# EAGLE schematic mmcaudio (EAGLE 6.4)
AUTHOR: Dat Le

## Sheet 1 of 3
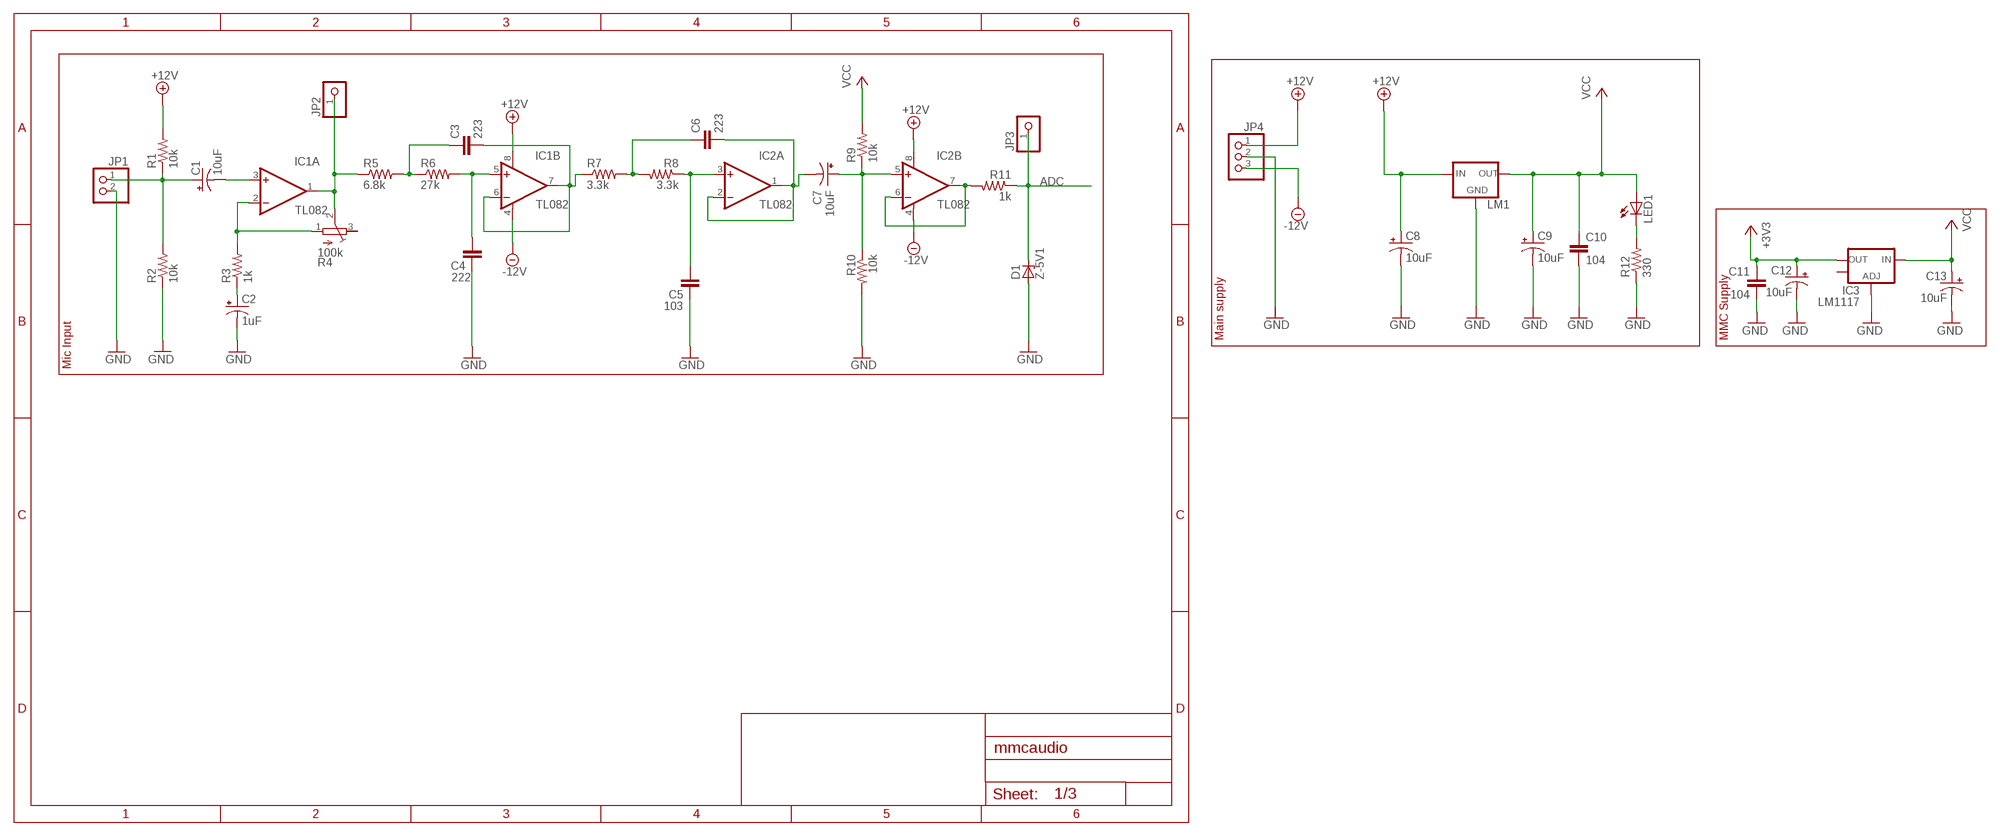
[diagram p0: schematic, sheet 1]

### Parts
C1  10uF  CPOL-USSANYO_D  [POL-CAP-COMMON]
C2  1uF  CPOL-USSANYO_D  [POL-CAP-COMMON]
C3  223  C-EUCERAMIC-CAP-COMMON  [C025-060X050]
C4  222  C-EUCERAMIC-CAP-COMMON  [C025-060X050]
C5  103  C-EUCERAMIC-CAP-COMMON  [C025-060X050]
C6  223  C-EUCERAMIC-CAP-COMMON  [C025-060X050]
C7  10uF  CPOL-USSANYO_D  [POL-CAP-COMMON]
C8  10uF  CPOL-USSANYO_D  [POL-CAP-COMMON]
C9  10uF  CPOL-USSANYO_D  [POL-CAP-COMMON]
C10  104  C-EUCERAMIC-CAP-COMMON  [C025-060X050]
C11  104  C-EUCERAMIC-CAP-COMMON  [C025-060X050]
C12  10uF  CPOL-USSANYO_D  [POL-CAP-COMMON]
C13  10uF  CPOL-USSANYO_D  [POL-CAP-COMMON]
D1  Z-5V1  [DO35Z7]
IC1  TL082  [DIP08]
IC2  TL082  [DIP08]
IC3  LM1117  V_REG_LM1117SOT223  [SOT223]
JP1  PINHD-1X2  [1X02]
JP2  PINHD-1X1  [1X01]
JP3  PINHD-1X1  [1X01]
JP4  PINHD-1X30.2"  [1X03/0.2"]
LED1  LED5MM  [LED5MM]
LM1  V_REG_78XXSINK  [TO220-IGO]
R1  10k  R-US_0207/10  [R-US-COMMON]
R2  10k  R-US_0207/10  [R-US-COMMON]
R3  1k  R-US_0207/10  [R-US-COMMON]
R4  100k  R-TRIMM64W  [RTRIM-COMMON]
R5  6.8k  R-US_0207/10  [R-US-COMMON]
R6  27k  R-US_0207/10  [R-US-COMMON]
R7  3.3k  R-US_0207/10  [R-US-COMMON]
R8  3.3k  R-US_0207/10  [R-US-COMMON]
R9  10k  R-US_0207/10  [R-US-COMMON]
R10  10k  R-US_0207/10  [R-US-COMMON]
R11  1k  R-US_0207/10  [R-US-COMMON]
R12  330  R-US_0207/10  [R-US-COMMON]

### Nets
+3V3: C11.1 C12.+ IC3.2(OUT) ; also sheet 2
+12V: C8.+ IC1.8(B:V+) IC2.8(B:V+) JP4.1 LM1.IN R1.2 ; also sheet 3
-12V: IC1.4(B:V-) IC2.4(B:V-) JP4.3 ; also sheet 3
ADC: D1.C JP3.1 R11.1 ; also sheet 2
GND: C2.- C4.1 C5.1 C8.- C9.- C10.2 C11.2 C12.- C13.- D1.A IC3.1(ADJ) JP1.2 JP4.2 LM1.GND R2.1 R10.2 R12.1 ; also sheet 2,3
N$1: C1.- IC1.3(A:+IN)
N$2: IC1.2(A:-IN) R3.2 R4.1(A)
N$3: IC1.1(A:OUT) JP2.1 R4.2(S) R5.1
N$4: C3.1 R5.2 R6.1
N$5: C4.2 IC1.5(B:+IN) R6.2
N$6: C3.2 IC1.6(B:-IN) IC1.7(B:OUT) R7.1
N$7: C6.1 R7.2 R8.2
N$8: C5.2 IC2.3(A:+IN) R8.1
N$9: C6.2 C7.- IC2.1(A:OUT) IC2.2(A:-IN)
N$10: C7.+ IC2.5(B:+IN) R9.1 R10.1
N$11: IC2.6(B:-IN) IC2.7(B:OUT) R11.2
N$13: C1.+ JP1.1 R1.1 R2.2
N$31: C2.+ R3.1
N$37: LED1.K(C) R12.2
VCC: C9.+ C10.1 C13.+ IC3.3(IN) LED1.A LM1.OUT R9.2 ; also sheet 2,3
Unconnected: IC3.4(OUT) R4.3(E)

### Notes on the sheet
- Main supply | MMC Supply
- Mic Input

## Sheet 2 of 3
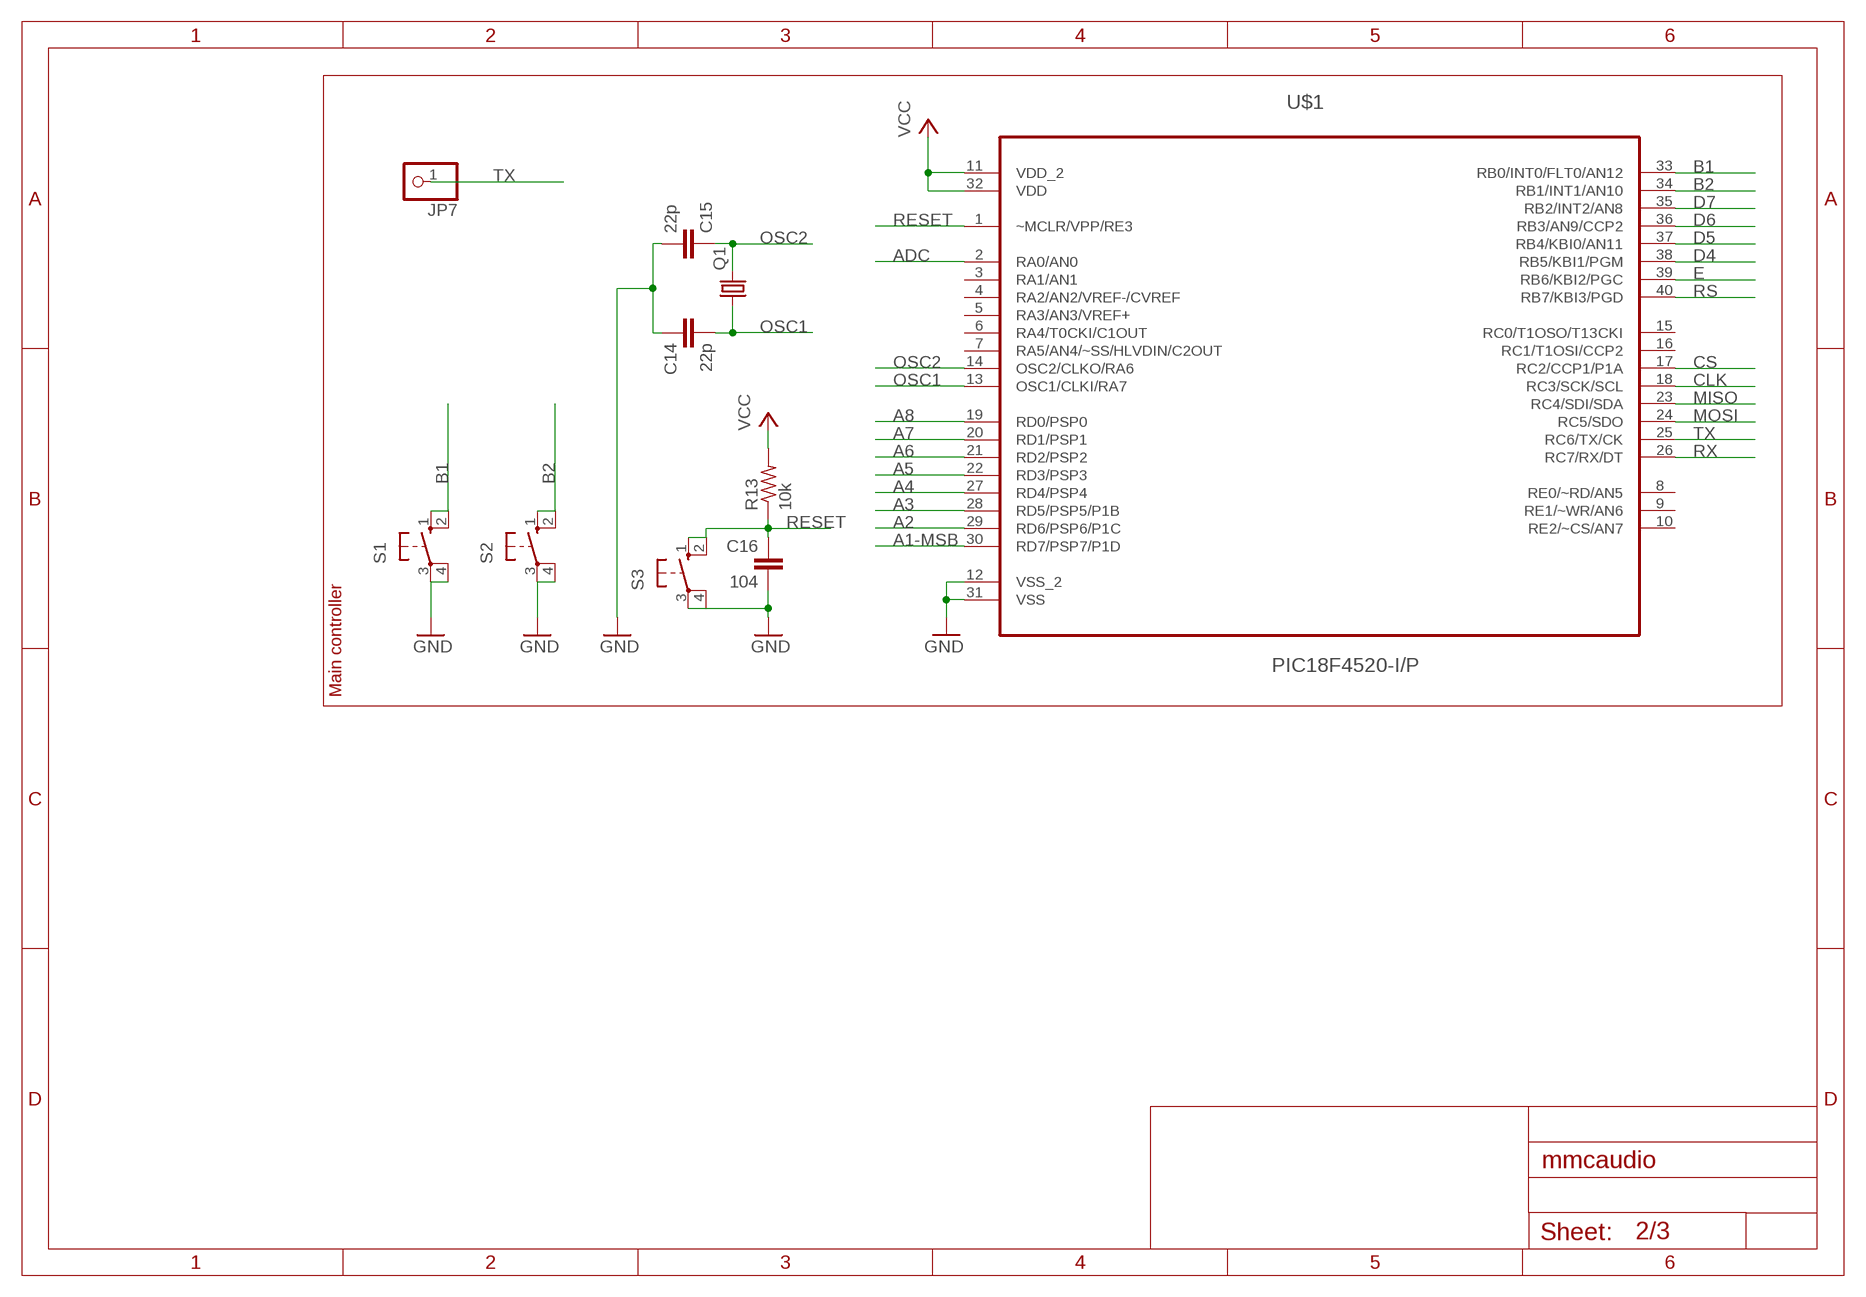
[diagram p1: schematic, sheet 2, part 1 of 2]
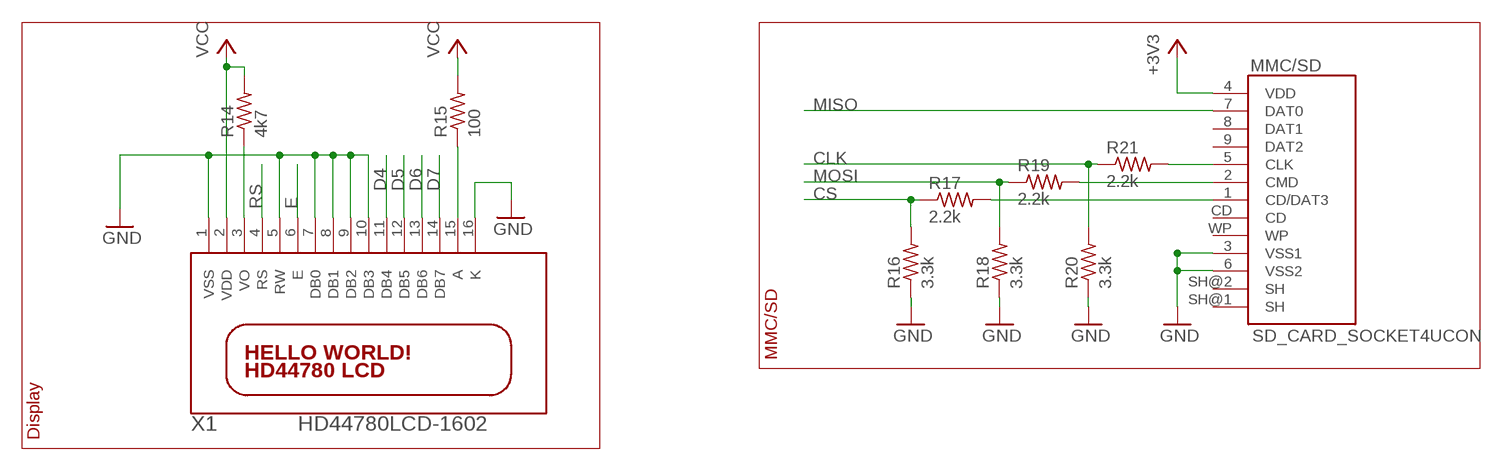
[diagram p2: schematic, sheet 2, part 2 of 2]

### Parts
C14  22p  C-EUCERAMIC-CAP-COMMON  [C025-060X050]
C15  22p  C-EUCERAMIC-CAP-COMMON  [C025-060X050]
C16  104  C-EUCERAMIC-CAP-COMMON  [C025-060X050]
JP7  PINHD-1X1  [1X01]
MMC/SD  SD_CARD_SOCKET4UCON  [SDCARD_4UCONN]
Q1  CRYSTALHC49S  [HC49/S]
R13  10k  R-US_0207/10  [R-US-COMMON]
R14  4k7  R-US_0207/10  [R-US-COMMON]
R15  100  R-US_0207/10  [R-US-COMMON]
R16  3.3k  R-US_0207/10  [R-US-COMMON]
R17  2.2k  R-US_0207/10  [R-US-COMMON]
R18  3.3k  R-US_0207/10  [R-US-COMMON]
R19  2.2k  R-US_0207/10  [R-US-COMMON]
R20  3.3k  R-US_0207/10  [R-US-COMMON]
R21  2.2k  R-US_0207/10  [R-US-COMMON]
S1  10-XX  [B3F-10XX]
S2  10-XX  [B3F-10XX]
S3  10-XX  [B3F-10XX]
U$1  PIC18F4520-I/P  [DIP254P1524X533-40]
X1  HD44780LCD-1602  [LCD1602]

### Nets
+3V3: MMC/SD.4(VDD) ; also sheet 1
A1-MSB: U$1.30(RD7/PSP7/P1D) ; also sheet 3
A2: U$1.29(RD6/PSP6/P1C) ; also sheet 3
A3: U$1.28(RD5/PSP5/P1B) ; also sheet 3
A4: U$1.27(RD4/PSP4) ; also sheet 3
A5: U$1.22(RD3/PSP3) ; also sheet 3
A6: U$1.21(RD2/PSP2) ; also sheet 3
A7: U$1.20(RD1/PSP1) ; also sheet 3
A8: U$1.19(RD0/PSP0) ; also sheet 3
ADC: U$1.2(RA0/AN0) ; also sheet 1
B1: S1.1(S) S1.2(S1) U$1.33(RB0/INT0/FLT0/AN12)
B2: S2.1(S) S2.2(S1) U$1.34(RB1/INT1/AN10)
CLK: R20.2 R21.1 U$1.18(RC3/SCK/SCL)
CONTR: R14.1 X1.3(VO)
CS: R16.2 R17.1 U$1.17(RC2/CCP1/P1A)
D4: U$1.38(RB5/KBI1/PGM) X1.11(DB4)
D5: U$1.37(RB4/KBI0/AN11) X1.12(DB5)
D6: U$1.36(RB3/AN9/CCP2) X1.13(DB6)
D7: U$1.35(RB2/INT2/AN8) X1.14(DB7)
E: U$1.39(RB6/KBI2/PGC) X1.6(E)
GND: C14.1 C15.2 C16.2 MMC/SD.3(VSS1) MMC/SD.6(VSS2) R16.1 R18.1 R20.1 S1.3(P) S1.4(P1) S2.3(P) S2.4(P1) S3.3(P) S3.4(P1) U$1.12(VSS_2) U$1.31(VSS) X1.16(K) ; also sheet 1,3
MISO: MMC/SD.7(DAT0) U$1.23(RC4/SDI/SDA)
MOSI: R18.2 R19.1 U$1.24(RC5/SDO)
N$32: R15.1 X1.15(A)
N$36: MMC/SD.1(CD/DAT3) R17.2
N$38: MMC/SD.2(CMD) R19.2
N$40: MMC/SD.5(CLK) R21.2
OSC1: C14.2 Q1.1 U$1.13(OSC1/CLKI/RA7)
OSC2: C15.1 Q1.2 U$1.14(OSC2/CLKO/RA6)
RESET: C16.1 R13.1 S3.1(S) S3.2(S1) U$1.1(~MCLR/VPP/RE3)
RS: U$1.40(RB7/KBI3/PGD) X1.4(RS)
RX: U$1.26(RC7/RX/DT)
TX: JP7.1 U$1.25(RC6/TX/CK)
VCC: R13.2 R15.2 U$1.11(VDD_2) U$1.32(VDD) ; also sheet 1,3
VDD: R14.2 X1.2(VDD) ; supply symbol labelled VCC
VSS: X1.1(VSS) X1.5(RW) X1.7(DB0) X1.8(DB1) X1.9(DB2) X1.10(DB3) ; supply symbol labelled GND
Unconnected: MMC/SD.8(DAT1) MMC/SD.9(DAT2) MMC/SD.CD MMC/SD.SH@1(SH) MMC/SD.SH@2(SH) MMC/SD.WP U$1.3(RA1/AN1) U$1.4(RA2/AN2/VREF-/CVREF) U$1.5(RA3/AN3/VREF+) U$1.6(RA4/T0CKI/C1OUT) U$1.7(RA5/AN4/~SS/HLVDIN/C2OUT) U$1.8(RE0/~RD/AN5) U$1.9(RE1/~WR/AN6) U$1.10(RE2/~CS/AN7) U$1.15(RC0/T1OSO/T13CKI) U$1.16(RC1/T1OSI/CCP2)

### Notes on the sheet
- MMC/SD
- Display
- Main controller

## Sheet 3 of 3
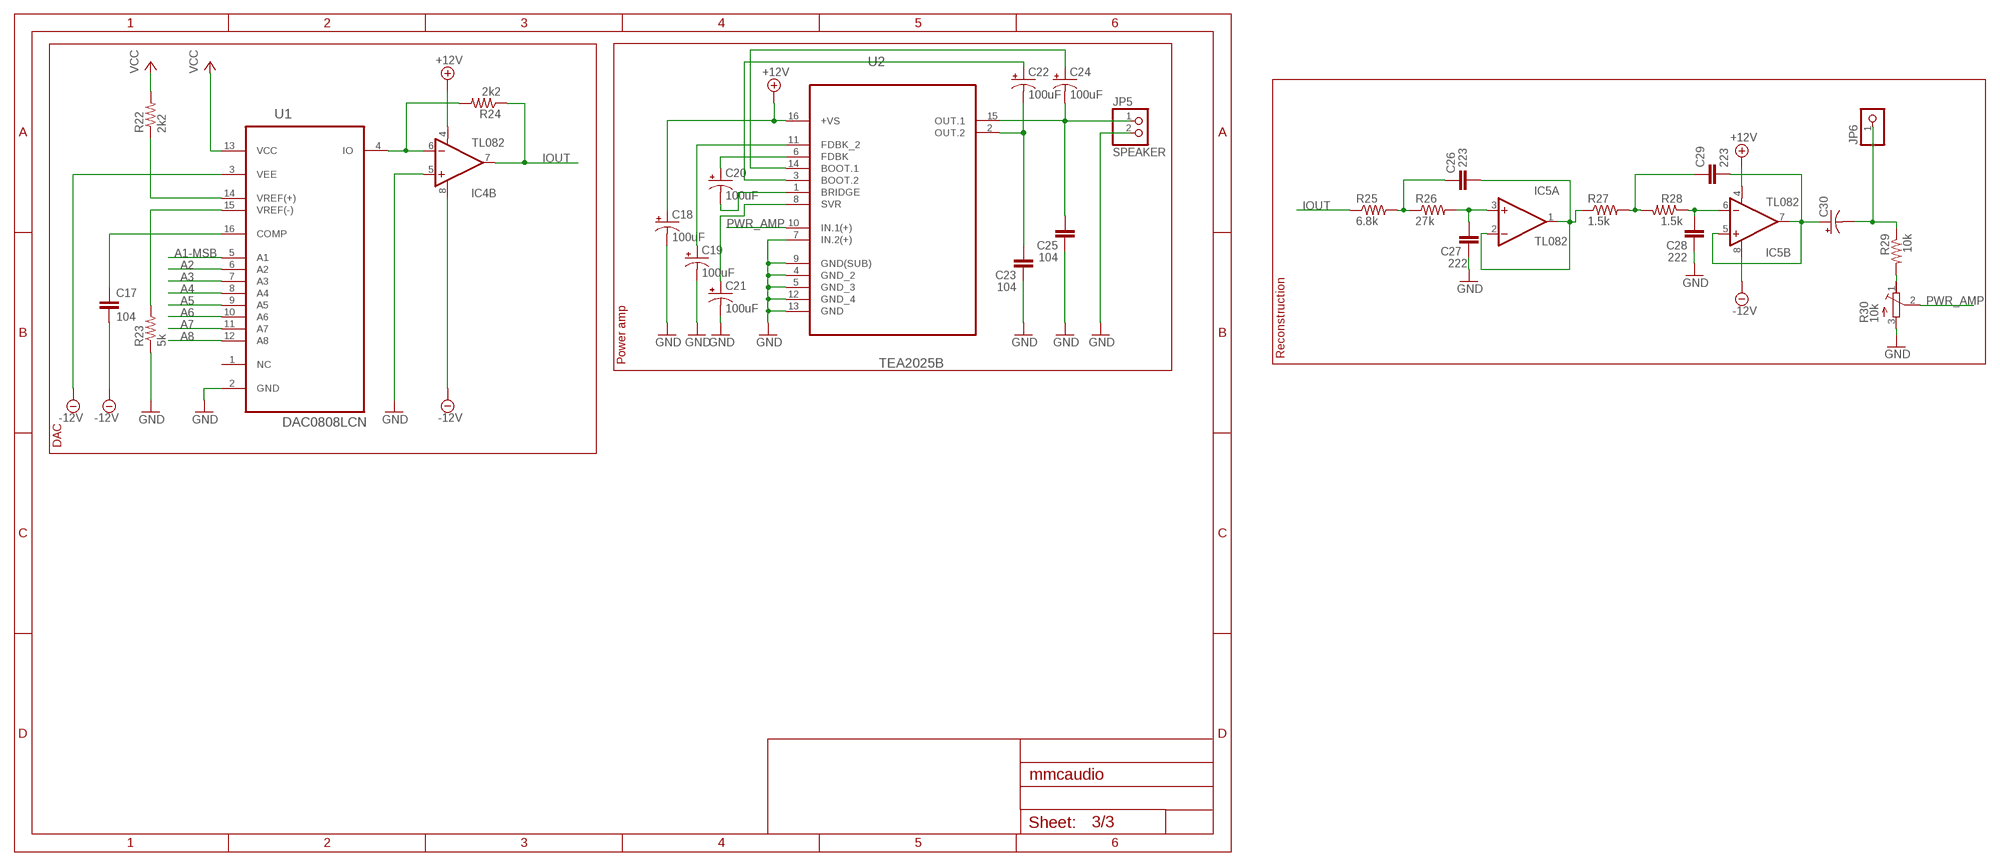
[diagram p3: schematic, sheet 3]

### Parts
C17  104  C-EUCERAMIC-CAP-COMMON  [C025-060X050]
C18  100uF  CPOL-USSANYO_D  [POL-CAP-COMMON]
C19  100uF  CPOL-USSANYO_D  [POL-CAP-COMMON]
C20  100uF  CPOL-USSANYO_D  [POL-CAP-COMMON]
C21  100uF  CPOL-USSANYO_D  [POL-CAP-COMMON]
C22  100uF  CPOL-USSANYO_D  [POL-CAP-COMMON]
C23  104  C-EUCERAMIC-CAP-COMMON  [C025-060X050]
C24  100uF  CPOL-USSANYO_D  [POL-CAP-COMMON]
C25  104  C-EUCERAMIC-CAP-COMMON  [C025-060X050]
C26  223  C-EUCERAMIC-CAP-COMMON  [C025-060X050]
C27  222  C-EUCERAMIC-CAP-COMMON  [C025-060X050]
C28  222  C-EUCERAMIC-CAP-COMMON  [C025-060X050]
C29  223  C-EUCERAMIC-CAP-COMMON  [C025-060X050]
C30  CPOL-USSANYO_D  [POL-CAP-COMMON]
IC4  TL082  [DIP08]
IC5  TL082  [DIP08]
JP5  SPEAKER  PINHD-1X20.5"  [1X02/0.5"]
JP6  PINHD-1X1  [1X01]
R22  2k2  R-US_0207/10  [R-US-COMMON]
R23  5k  R-US_0207/10  [R-US-COMMON]
R24  2k2  R-US_0207/10  [R-US-COMMON]
R25  6.8k  R-US_0207/10  [R-US-COMMON]
R26  27k  R-US_0207/10  [R-US-COMMON]
R27  1.5k  R-US_0207/10  [R-US-COMMON]
R28  1.5k  R-US_0207/10  [R-US-COMMON]
R29  10k  R-US_0207/10  [R-US-COMMON]
R30  10k  R-TRIMM  [POT]
U1  DAC0808LCN  [DIP254P762X508-16]
U2  TEA2025B  [DIP254P762X510-16]

### Nets
+12V: C18.+ IC4.4(B:V-) IC5.4(B:V-) U2.16(+VS) ; also sheet 1
-12V: C17.2 IC4.8(B:V+) IC5.8(B:V+) U1.3(VEE) ; also sheet 1
A1-MSB: U1.5(A1) ; also sheet 2
A2: U1.6(A2) ; also sheet 2
A3: U1.7(A3) ; also sheet 2
A4: U1.8(A4) ; also sheet 2
A5: U1.9(A5) ; also sheet 2
A6: U1.10(A6) ; also sheet 2
A7: U1.11(A7) ; also sheet 2
A8: U1.12(A8) ; also sheet 2
GND: C18.- C19.- C21.- C23.1 C25.1 C27.1 C28.1 IC4.5(B:+IN) JP5.2 R23.1 R30.3(A) U1.2(GND) U2.4(GND_2) U2.5(GND_3) U2.7(IN.2(+)) U2.9(GND(SUB)) U2.12(GND_4) U2.13(GND) ; also sheet 1,2
IOUT: IC4.7(B:OUT) R24.1 R25.1
N$14: C26.1 R25.2 R26.1
N$15: C27.2 IC5.3(A:+IN) R26.2
N$16: C26.2 IC5.1(A:OUT) IC5.2(A:-IN) R27.1
N$17: C29.1 R27.2 R28.2
N$18: C28.2 IC5.6(B:-IN) R28.1
N$19: C29.2 C30.+ IC5.5(B:+IN) IC5.7(B:OUT)
N$21: C30.- JP6.1 R29.1
N$22: C19.+ U2.11(FDBK_2)
N$23: C20.+ U2.6(FDBK)
N$24: C20.- U2.1(BRIDGE)
N$25: C24.- C25.2 JP5.1 U2.15(OUT.1)
N$26: C24.+ U2.14(BOOT.1)
N$27: C22.- C23.2 U2.2(OUT.2)
N$28: C22.+ U2.3(BOOT.2)
N$29: C21.+ U2.8(SVR)
N$30: R29.2 R30.1(E)
N$33: C17.1 U1.16(COMP)
N$34: IC4.6(B:-IN) R24.2 U1.4(IO)
PWR_AMP: R30.2(S) U2.10(IN.1(+))
VCC: R22.2 U1.13(VCC) ; also sheet 1,2
VREF+: R22.1 U1.14(VREF(+))
VREF-: R23.2 U1.15(VREF(-))
Unconnected: IC4.1(A:OUT) IC4.2(A:-IN) IC4.3(A:+IN) U1.1(NC)

### Notes on the sheet
- Reconstruction
- Power amp
- DAC

## Library data of the parts
C1 C2 C7-C9 C12 C13 C18-C22 C24 C30 = datle-discrete:CPOL-US: POLARIZED CAPACITOR, American symbol
C3-C6 C10 C11 C14-C17 C23 C25-C29 = datle-discrete:C-EU: CAPACITOR, European symbol
D1 = datle-discrete:Z-5V1
IC1 IC2 IC4 IC5 = datle-analogic:TL082
IC3 = datle-powerIC:V_REG_LM1117: Voltage Regulator LM1117 Standard adjustable voltage regulator but in SMD form. Spark Fun Electronics SKU : COM-00595
JP1 JP5 = datle-conn:PINHD-1X2: PIN HEADER
JP2 JP3 JP6 JP7 = datle-conn:PINHD-1X1: PIN HEADER
JP4 = datle-conn:PINHD-1X3: PIN HEADER
LED1 = datle-discrete:LED: LEDs Standard schematic elements and footprints for 5mm, 3mm, 1206, and 0603 sized LEDs. 5mm - Spark Fun Electronics SKU : COM-00529 (and others)
LM1 = datle-powerIC:V_REG_78XX: Voltage Regulator Standard 7805 5V regulator. IGO (Input Ground Output). Spark Fun Electronics SKU : COM-00107
MMC/SD = datle-discrete:SD_CARD_SOCKET: SD Memory Card Connector, push-push normal type, CD enable, WP enable
Q1 = datle-discrete:CRYSTAL: CRYSTAL; OC_FARNELL: 1667008; OC_NEWARK: unknown
R1-R3 R5-R29 = datle-discrete:R-US_: RESISTOR, American symbol
R4 R30 = datle-discrete:R-TRIMM: Trimm resistor
S1-S3 = datle-switch:10-XX: OMRON SWITCH; MPN: B3F-1000; OC_FARNELL: 176432; OC_NEWARK: 36M3542
U1 = datle-analogic:DAC0808LCN: D/A Converter; MPN: DAC0808LCN; OC_FARNELL: 9486658; OC_NEWARK: 07B5074; PACKAGE: 16-DIP; SUPPLIER: National Semiconductor
U2 = datle-analogic:TEA2025B: STREO AUDIO AMPLIFIER; MPN: TEA2025B; OC_FARNELL: 1263004; OC_NEWARK: 89K1062; PACKAGE: PDIP-16; SUPPLIER: STMICROELECTRONICS
U$1 = datle-mcu:PIC18F4520-I/P: Flash Microcontrollers; MPN: PIC18F4520-I/P; OC_FARNELL: 1212702; OC_NEWARK: 01M8488; PACKAGE: DIP-40; SUPPLIER: Microchip
X1 = datle-display:HD44780LCD: HD44780 LCD Standard character type LCDs, available in sizes from 8x1 to 40x4!